# EAGLE design ltc1420_adc (EAGLE 7.6.0)
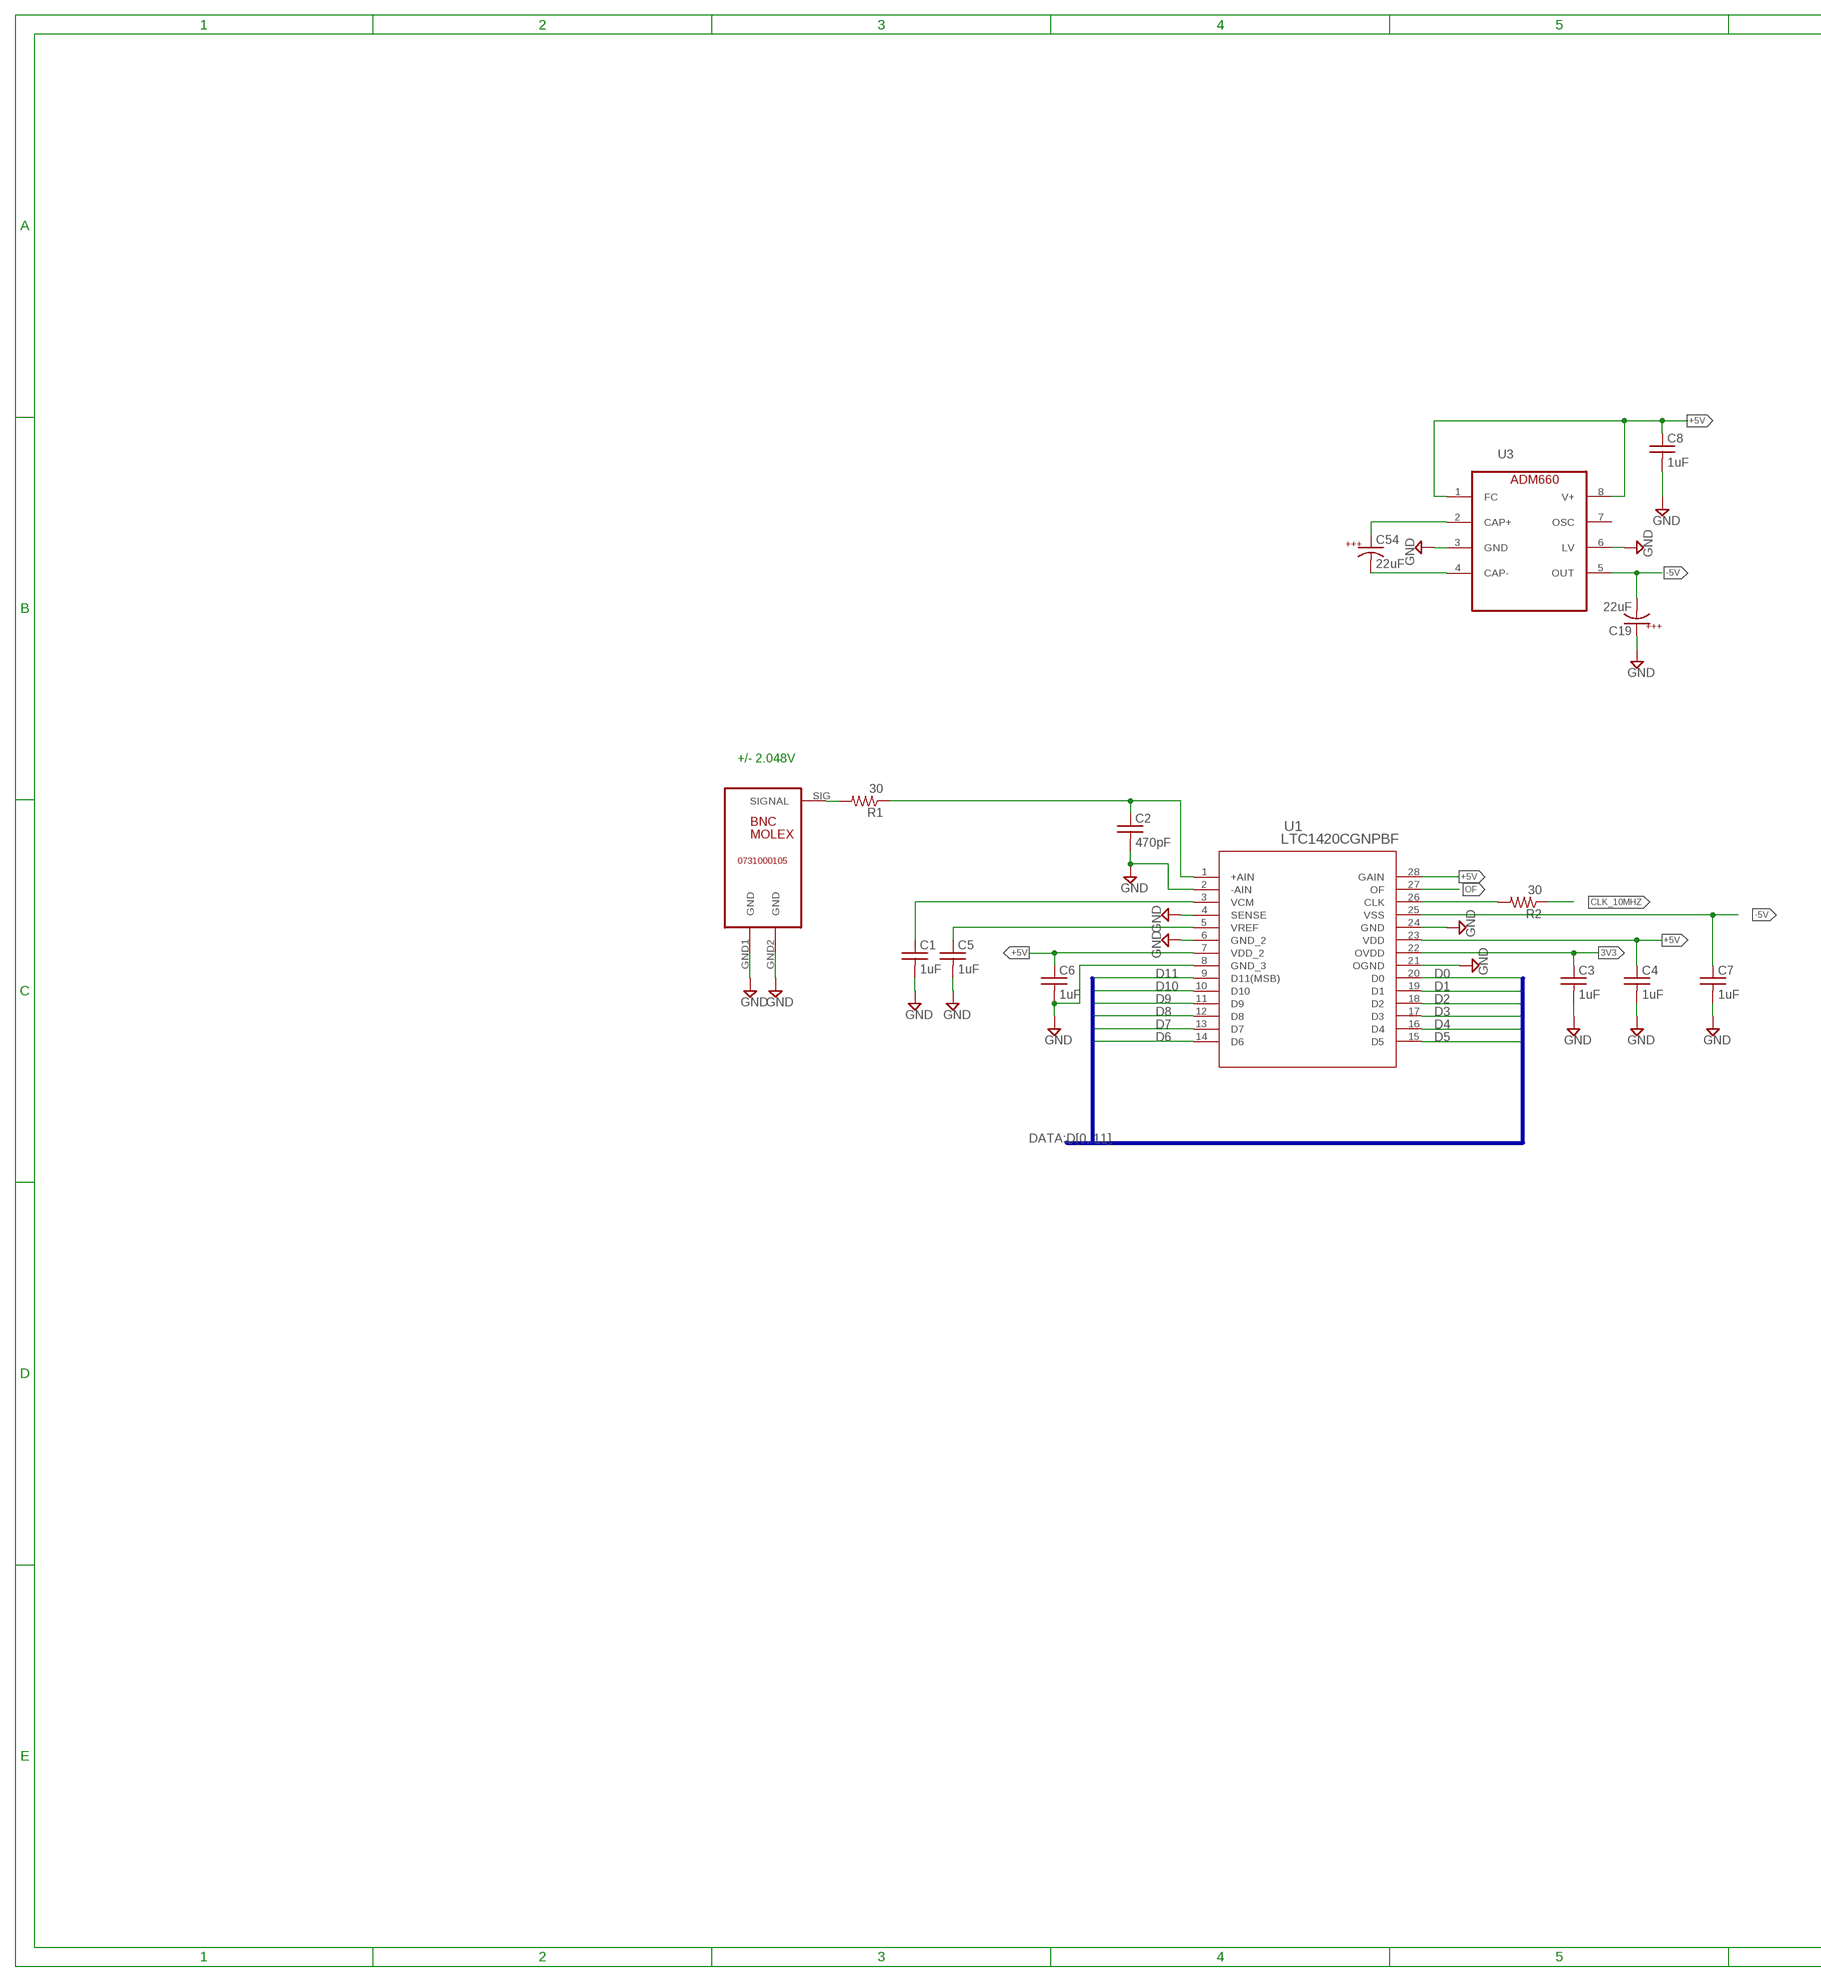
[diagram p0: schematic, sheet 1, part 1 of 2]
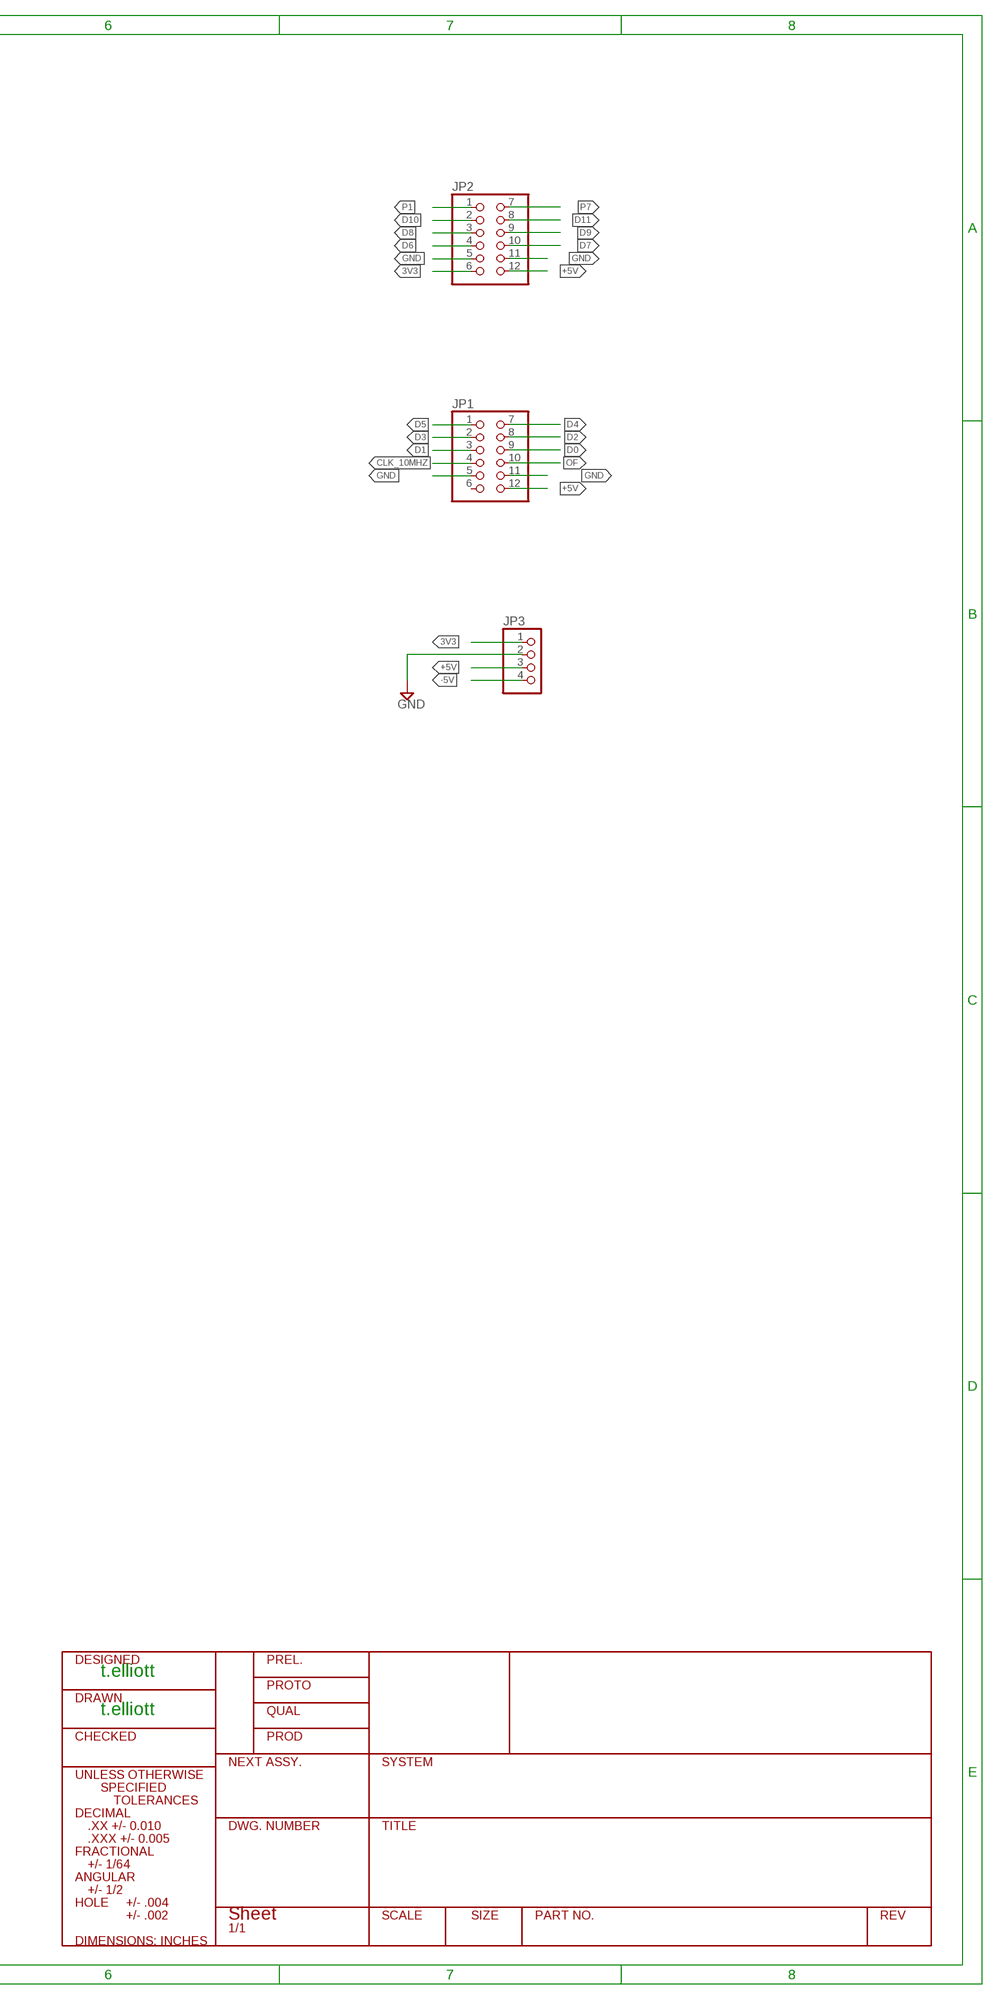
[diagram p1: schematic, sheet 1, part 2 of 2]

## Parts
C1  1uF  C-USC0603  [C0603]
C2  470pF  C-USC0603  [C0603]
C3  1uF  C-USC0603  [C0603]
C4  1uF  C-USC0603  [C0603]
C5  1uF  C-USC0603  [C0603]
C6  1uF  C-USC0603  [C0603]
C7  1uF  C-USC0603  [C0603]
C8  1uF  C-USC0603  [C0603]
C19  22uF  CAPACITOR1210K  [1210K]
C54  22uF  CAPACITOR1210K  [1210K]
J1  0731000105_MOLEX_BNC  [BNC]
JP1  PINHD-2X6  [2X06]
JP2  PINHD-2X6  [2X06]
JP3  PINHD-1X4  [1X04]
R1  30  R-US_R0402  [R0402]
R2  30  R-US_R0402  [R0402]
U1  LTC1420CGNPBF  [SSOP-28_GN]
U3  ADM660  [SO8]

## Nets
3V3: C3.1 JP2.6 JP3.1 U1.22(OVDD)
+5V: C4.1 C6.1 C8.1 JP1.12 JP2.12 JP3.3 U1.7(VDD_2) U1.23(VDD) U1.28(GAIN) U3.1(FC) U3.8(V+)
-5V: C7.1 C19.C JP3.4 U1.25(VSS) U3.5(OUT)
CLK_10MHZ: JP1.4 R2.1
D0: JP1.9 U1.20(D0)
D1: JP1.3 U1.19(D1)
D2: JP1.8 U1.18(D2)
D3: JP1.2 U1.17(D3)
D4: JP1.7 U1.16(D4)
D5: JP1.1 U1.15(D5)
D6: JP2.4 U1.14(D6)
D7: JP2.10 U1.13(D7)
D8: JP2.3 U1.12(D8)
D9: JP2.9 U1.11(D9)
D10: JP2.2 U1.10(D10)
D11: JP2.8 U1.9(D11(MSB))
GND: C1.2 C2.2 C3.2 C4.2 C5.2 C6.2 C7.2 C8.2 C19.A J1.GND1(GND) J1.GND2(GND) JP1.5 JP1.11 JP2.5 JP2.11 JP3.2 U1.2(-AIN) U1.4(SENSE) U1.6(GND_2) U1.8(GND_3) U1.21(OGND) U1.24(GND) U3.3(GND) U3.6(LV)
N$1: C2.1 R1.1 U1.1(+AIN)
N$2: C1.1 U1.3(VCM)
N$3: J1.SIG(SIGNAL) R1.2
N$4: C5.1 U1.5(VREF)
N$5: R2.2 U1.26(CLK)
N$6: C54.A U3.2(CAP+)
N$7: C54.C U3.4(CAP-)
OF: JP1.10 U1.27(OF)
P1: JP2.1
P7: JP2.7
Unconnected: JP1.6 U3.7(OSC)

## Buses
DATA:D[0..11]

## Notes on the sheet
- +/- 2.048V
- t.elliott
- t.elliott

## Library data of the parts
C1-C8 = misclib1:C-US: CAPACITOR, American symbol
C19 C54 = misclib2:CAPACITOR
J1 = molex_bnc:0731000105_MOLEX_BNC
JP1 JP2 = pinhead:PINHD-2X6: PIN HEADER
JP3 = pinhead:PINHD-1X4: PIN HEADER
R1 R2 = resistor:R-US_: RESISTOR, American symbol
U1 = ltc1420:LTC1420CGNPBF; MANUFACTURER_PART_NUMBER: ltc1420cgn#pbf; VENDOR: Linear Technology
U3 = adm660:ADM660

## Net classes
1 differential: width 0.203 mm, clearance 0.152 mm

## Board
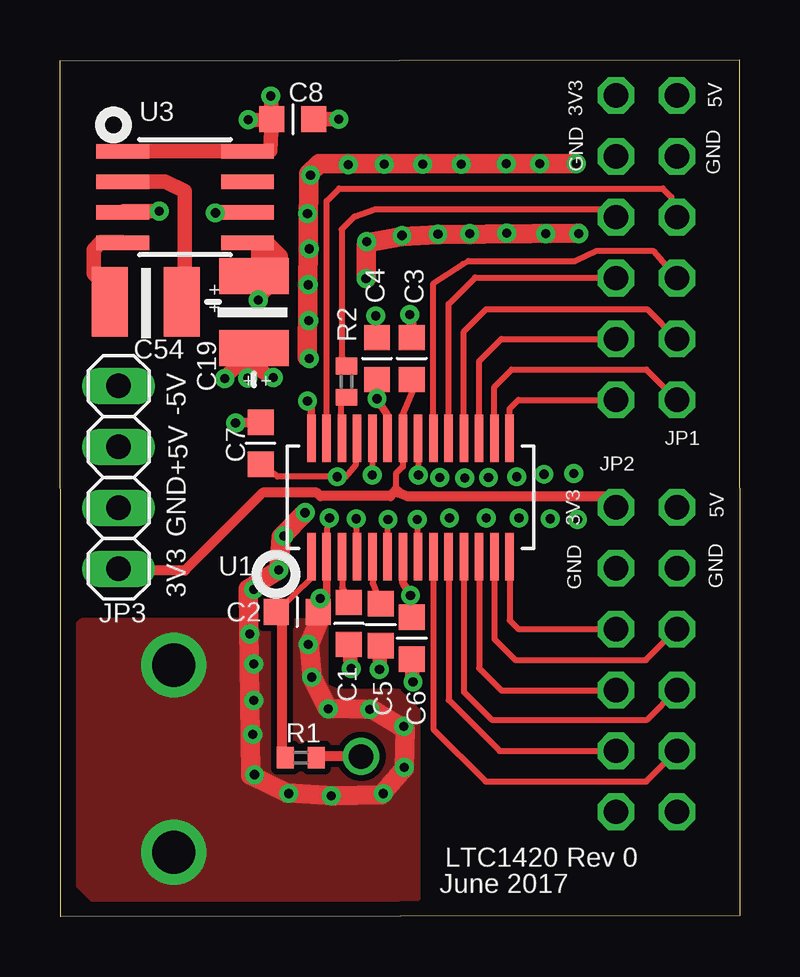
[diagram p2: board, top side]
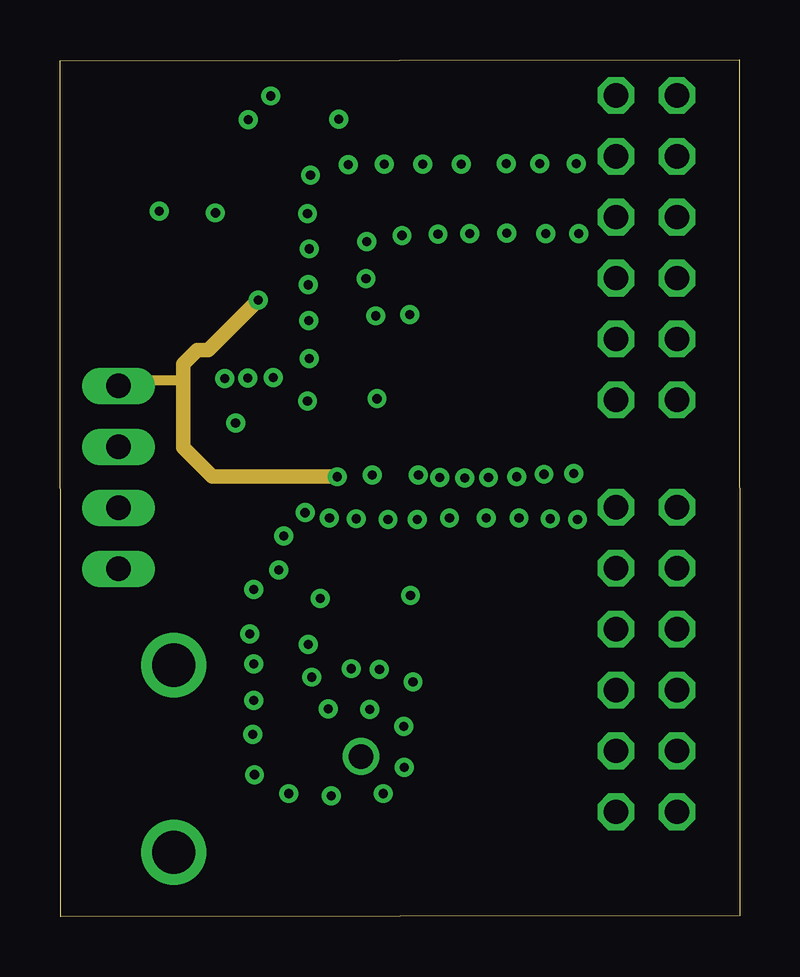
[diagram p3: board, inner layer Route2]
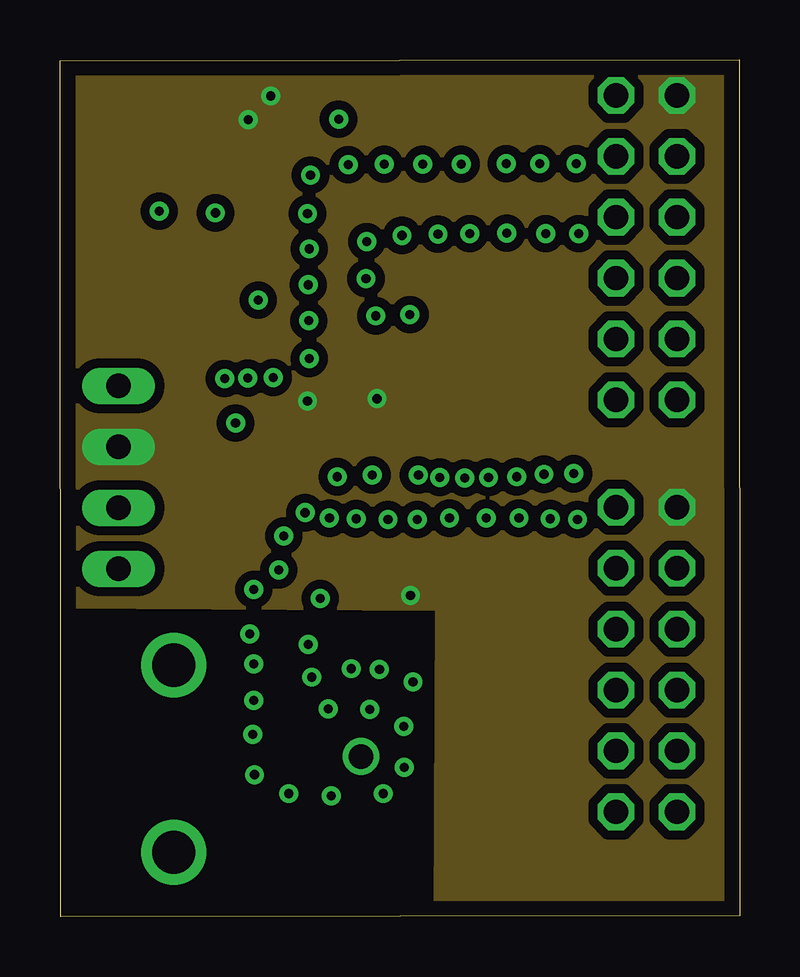
[diagram p4: board, inner layer Route3]
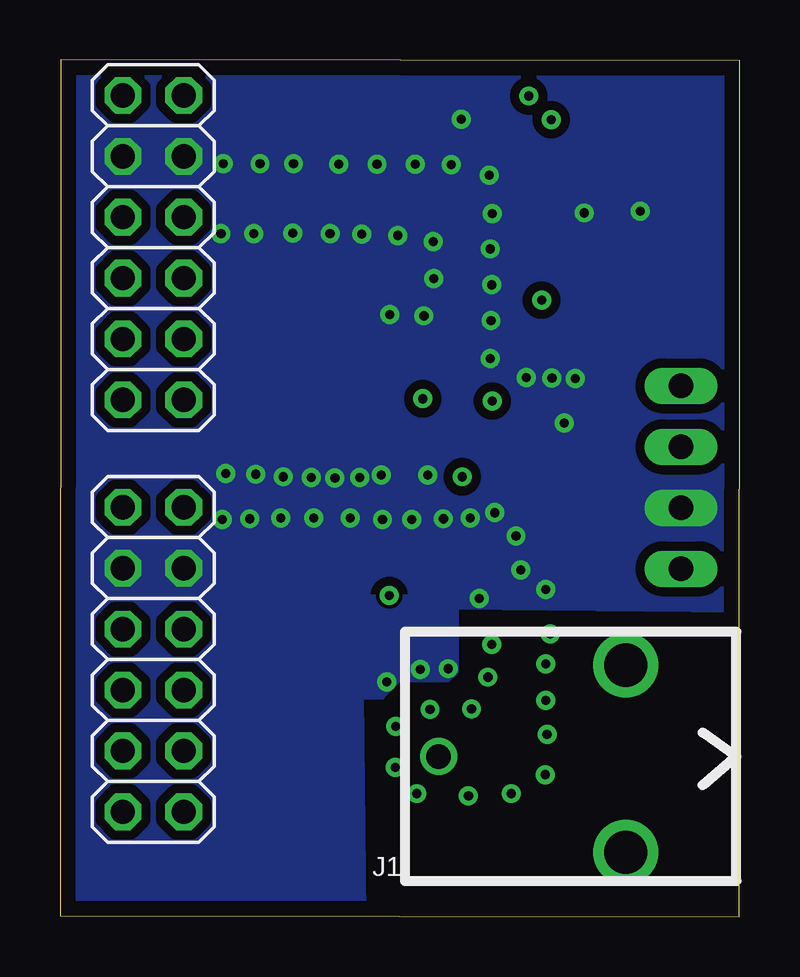
[diagram p5: board, bottom side, seen from below]

Size 28.32 x 35.71 mm. Coordinates in mm from the lower left corner, seen from the top.
Outline: 0,35.69 28.3,35.71 28.32,0.03 0.03,0 0,35.69
Copper layers (1+2+3+16): Top 0.035mm / dielectric 0.2mm / Route2 0.035mm / dielectric 0.15mm / Route3 0.035mm / dielectric 0.2mm / Bottom 0.035mm
Design rules "default *": minimum track width 6mil, minimum drill 10mil, track to track 6mil, track to pad 6mil, pad to pad 6mil, via to via 6mil, smd to smd 0mil, copper to edge 25mil, drill to drill 6mil, minimum pad ring 10mil, minimum via ring 8mil, stop-mask expansion 0mil, vias tented up to drill 50mil, thermal gap 10mil

### Footprints (pad centres in the part's own frame; a part is rotated, then mirrored left to right if it is on the bottom)
C0603 = smd 1.05 x 1.08: 1 -0.875,0; 2 0.875,0
1210K = smd 1.5 x 2.9: A -1.5,0; C 1.5,0
BNC = drill 1.8: GND1 -4,-2.8; GND2 3.8,-2.8 | drill 1.02: SIG 0,5
2X06 = drill 1.016 octagon: 1 -6.35,-1.27; 2 -3.81,-1.27; 3 -1.27,-1.27; 4 1.27,-1.27; 5 3.81,-1.27; 6 6.35,-1.27; 7 -6.35,1.27; 8 -3.81,1.27; 9 -1.27,1.27; 10 1.27,1.27; 11 3.81,1.27; 12 6.35,1.27
1X04 = drill 1.016 long: 1 -3.81,0; 2 -1.27,0; 3 1.27,0; 4 3.81,0
R0402 = smd 0.7 x 0.9: 1 -0.65,0; 2 0.65,0
SSOP-28_GN = smd 1.981 x 0.356: 1 -2.464,4.128; 2 -2.464,3.493; 3 -2.464,2.857; 4 -2.464,2.223; 5 -2.464,1.587; 6 -2.464,0.953; 7 -2.464,0.318; 8 -2.464,-0.318; 9 -2.464,-0.953; 10 -2.464,-1.587; 11 -2.464,-2.223; 12 -2.464,-2.857; 13 -2.464,-3.493; 14 -2.464,-4.128; 15 2.464,-4.128; 16 2.464,-3.493; 17 2.464,-2.857; 18 2.464,-2.223; 19 2.464,-1.587; 20 2.464,-0.953; 21 2.464,-0.318; 22 2.464,0.318; 23 2.464,0.953; 24 2.464,1.587; 25 2.464,2.223; 26 2.464,2.857; 27 2.464,3.493; 28 2.464,4.128
SO8 = smd 0.6 x 2.2: 1 -1.905,-2.62; 2 -0.635,-2.62; 3 0.635,-2.62; 4 1.905,-2.62; 5 1.905,2.58; 6 0.635,2.58; 7 -0.635,2.58; 8 -1.905,2.58

### Placement (x,y rotation side)
C1  12.04,12.22 270 top
C2  9.88,12.7 0 top
C3  14.66,23.27 90 top
C4  13.21,23.27 90 top
C5  13.36,12.17 270 top
C6  14.66,11.61 270 top
C7  8.36,19.74 90 top
C8  9.7,33.25 0 top
C19  8.08,25.2 90 top
C54  3.58,25.63 180 top
J1  7.54,6.68 90 bottom
JP1  24.43,27.89 90 bottom
JP2  24.43,10.72 90 bottom
JP3  2.44,18.31 90 top
R1  10.03,6.63 0 top
R2  11.94,22.3 270 top
U1  14.61,17.48 90 top
U3  5.23,30 270 top

### Tracks (layer width: path | path; a pad name or v marks a point on that pad's centre or on a via)
3V3
  Top 0.254: C3.1 14.45,22.19 14.71,21.89 14.29,20.92 U1.22 14.29,18.76 14,18.47 14,17.8 14.1,17.7
  Top 0.406: 14.1,17.7 14.1,17.68 14.48,17.53 22.94,17.53 JP2.6 | 14,17.8 14,17.76 13.77,17.53 10.85,17.53 10.69,17.68 8.46,17.68 5.21,14.43 2.18,14.43 2.26,14.5 JP3.1
+5V  (via drill 0.38)
  Top 0.305: U1.23 13.68,20.84 v13.21,21.59 | U1.28 10.48,21.32 v10.31,21.49 | U1.7 14.29,13.93 v14.61,13.39 C6.1 | 12.99,22.28 C4.1
  Top 0.406: v13.21,21.59 C4.1
  Top 0.61: U3.1 U3.8 8.76,31.93 8.82,33.16 | 8.82,33.16 C8.1 v8.79,34.21 | 8.82,33.16 7.82,33.25
  other vias: 7.85,33.22
  pour Route3 (isolate 0.381, no thermals): 0.1,35.59 28.17,35.61 28.19,0.1 15.67,-0.03 15.75,12.83 0.05,12.93
-5V  (via drill 0.38)
  Top 0.254: U1.25 12.32,18.82 12,18.44 | 12,18.44 11.91,18.34 v11.56,18.34 | v11.56,18.34 9.07,18.34 C7.1 | v11.56,18.34 11.66,18.44 12,18.44
  Top 0.61: U3.5 8.1,28.09 | 8.1,28.09 8.64,28.09 9.2,27.53 9.2,26.77 9.12,26.7 | 9.12,26.7 C19.C | 8.26,27.94 8.86,27.33 8.92,27.33 8.31,26.72 8.31,26.67 | 8.1,28.09 8.26,27.94 | 8.26,27.94 8.26,26.92 | 9.12,26.7 8.26,25.83 v8.26,25.71
  Route2 0.406: JP3.4 2.69,22.38 5.13,22.38
  Route2 0.61: v8.26,25.71 6.17,23.62 5.72,23.62 5.13,23.04 5.13,22.38 5.13,19.56 6.35,18.34 v11.56,18.34
CLK_10MHZ
  Top 0.254: 23.14,29.18 JP1.4 23.06,29.16 22.73,29.49 13.13,29.49 12.27,29.18 11.74,28.65 11.74,23.32 11.94,23.11 R2.1
D0
  Top 0.254: U1.20 15.56,26.4 16.79,27.2 17.02,27.33 21.46,27.33 22.38,27.76 24.71,27.76 JP1.9
D1
  Top 0.254: U1.19 16.19,25.54 17.3,26.64 23.14,26.64 JP1.3
D2
  Top 0.254: U1.18 16.83,24.4 17.75,25.32 24.46,25.32 JP1.8
D3
  Top 0.254: U1.17 17.46,23.15 18.39,24.08 JP1.2
D4
  Top 0.254: U1.16 18.1,22.09 18.82,22.81 24.44,22.81 JP1.7
D5
  Top 0.254: U1.15 18.73,21.17 19.1,21.54 JP1.1
D6
  Top 0.254: U1.14 18.73,12.36 19.1,11.99 JP2.4
D7
  Top 0.254: U1.13 18.1,11.57 18.97,10.69 24.41,10.69 JP2.10
D8
  Top 0.254: U1.12 17.46,10.35 18.39,9.42 23.14,9.42 JP2.3
D9
  Top 0.254: U1.11 16.83,9.36 17.98,8.2 24.46,8.2 JP2.9
D10
  Top 0.254: U1.10 16.19,9.03 18.31,6.91 JP2.2
D11
  Top 0.254: U1.9 15.56,7.81 17.73,5.64 24.44,5.64 JP2.8
GND  (via drill 0.38)
  Top 0.254: U1.21 14.92,18.43 v14.94,18.41 | U1.24 13.02,18.43 v13.01,18.41 | U1.8 v14.88,16.56 | U1.6 v13.67,16.56 | U1.4 v12.34,16.59 | 11.11,14.98 11.15,16.61 11.23,16.64
  Top 0.305: C4.2 13.21,24.38 v13.16,25.04 | U1.2 11.11,14.98 11.11,13.42 | C2.2 11.11,12.65 11.11,13.42 | 11.11,13.42 v10.85,13.26
  Top 0.406: C3.2 14.66,25.02 v14.58,25.09 | C7.2 v7.32,20.57
  Top 0.61: v14.71,9.78 C6.2 | v13.31,10.31 C5.2 | v12.14,10.34 C1.2 | C8.2 v11.61,33.25 | U3.3 2.66,29.41 v4.14,29.41 | v6.48,29.34 6.5,29.36 U3.6 | C19.A 7.82,23.44 v7.82,22.45 | C19.A arc79 8.86,22.48 | C19.A 6.86,22.48 6.83,22.48
  Top 0.813: v21.51,31.39 10.8,31.39 10.36,30.96 10.31,23.32 | v12.75,26.59 12.75,27.99 12.85,28.09 14.22,28.35 15.77,28.42 21.59,28.5 | v10.21,16.84 9.22,15.82 v9.12,14.45 7.85,13.67 7.95,5.89 9.45,5.16 11.43,5.03 13.39,5.08 14.35,6.17 14.38,7.8 13.01,8.64 11.15,8.69 10.52,9.96 10.39,11.35 10.87,12.52 10.85,13.23
  other vias: 21.62,28.47 20.24,28.47 18.62,28.5 17.07,28.47 15.75,28.45 14.25,28.4 12.78,28.14 19.99,31.39 18.59,31.39 16.71,31.37 15.11,31.37 13.51,31.37 12.01,31.34 10.31,29.31 10.39,27.84 10.34,26.34 10.36,24.84 10.39,23.27 10.44,30.91 9.32,15.88 8.08,13.64 7.9,11.79 8.08,10.54 8.08,9.02 8.03,7.59 8.1,5.92 9.52,5.13 11.3,5.03 13.46,5.13 14.35,6.22 14.33,7.92 12.9,8.64 11.18,8.66 10.49,9.98 10.34,11.35 11.23,16.61 8.89,22.48 6.86,22.43 16.23,16.61 17.75,16.61 19.13,16.61 20.42,16.59 21.56,16.56 21.41,18.47 20.17,18.44 19.02,18.34 17.86,18.31 16.87,18.29 15.82,18.31
  pour Bottom (isolate 0.381, no thermals): 0.18,35.51 28.24,35.53 28.27,0.03 15.65,-0.05 15.8,12.95 0.08,12.78
  pour Top (isolate 0.254, no thermals): 8.05,12.29 8.03,12.32 0.91,12.32 0.38,11.79 0.38,1.7 1.55,0.53 14.66,0.53 14.91,0.79 14.91,8.56 14.1,9.37 11.56,9.37 11.07,9.58 11.07,12.19 10.67,12.32
  pour Bottom: 11.84,13.06 11.84,10.21 12.17,9.88 14.2,9.88 14.91,9.17 15.75,9.17 15.82,9.25 15.82,13.13 15.62,13.34 11.99,13.34 11.84,13.18 11.84,13.08
N$1
  Top 0.254: U1.1 10.49,14.15 C2.1
  Top 0.305: 9.25,12.53 C2.1
  Top 0.406: 9.25,12.53 9.25,6.77 R1.1
N$2
  Top 0.254: U1.3 11.76,13.72 C1.1
N$3
  Top 0.406: J1.SIG 10.73,6.68 R1.2
N$4
  Top 0.254: U1.5 13.03,13.89 C5.1
N$5
  Top 0.254: U1.26 11.71,19.98 11.71,21.49 11.87,21.65 R2.2
N$6
  Top 0.61: U3.2 4.39,30.63 5.21,30.25 5.21,26.39 5.08,26.08 C54.A
N$7
  Top 0.61: U3.4 2.59,28.12 1.7,28.12 1.4,27.81 1.4,26.8 2.08,26.11 C54.C
OF
  Top 0.254: U1.27 11.11,29.83 11.63,30.35 25.12,30.35 25.48,30 25.48,29.39 JP1.10

### Text on the board
tPlace: 3V3 | 5V | GND | GND | -5V | +5V | 3V3 | 5V | GND | 3V3 | GND | GND | LTC1420 Rev 0 | June 2017